# EAGLE design csa_pwr-v1.3b (EAGLE 5.11)

## Sheet 1 of 3
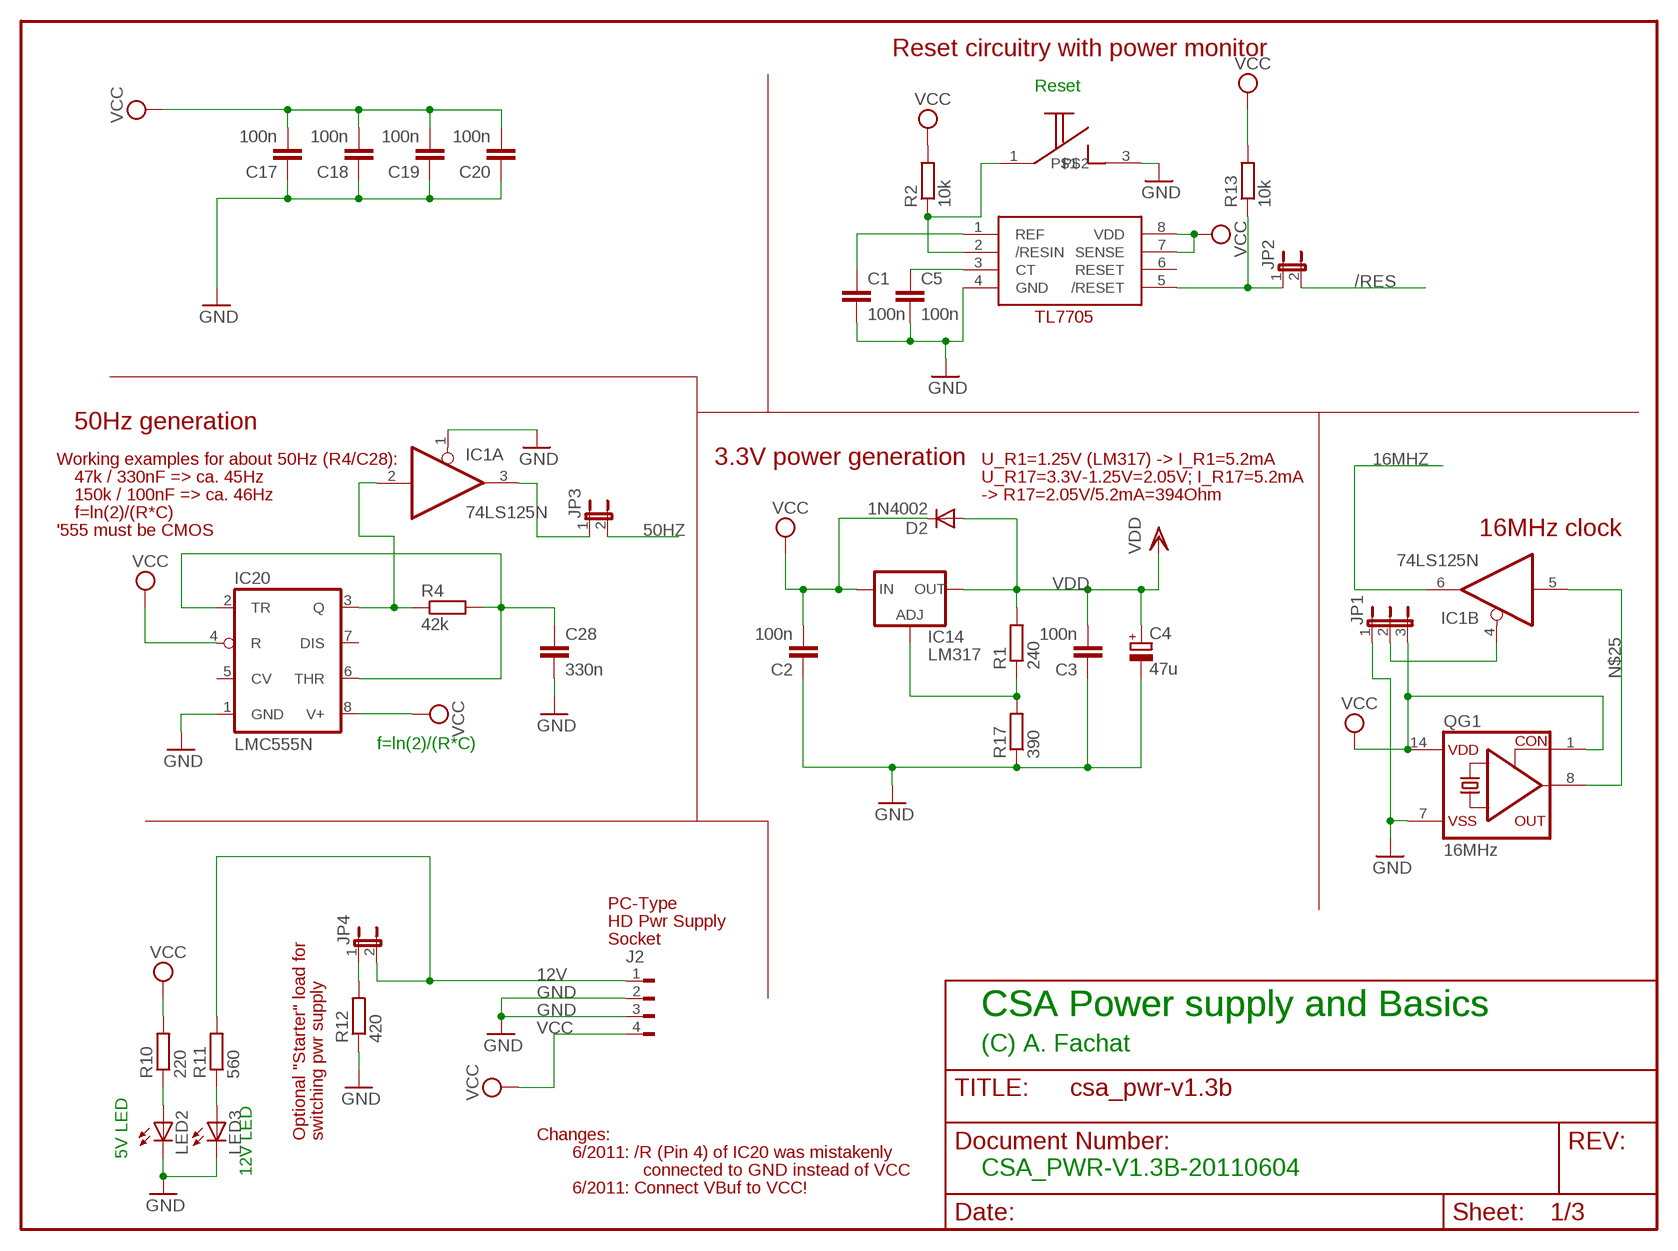
[diagram p0: schematic, sheet 1]

### Parts
C1  100n  C-EU025-025X050  [C025-025X050]
C2  100n  C5/2.5  [C5B2.5]
C3  100n  C5/2.5  [C5B2.5]
C4  47u  CPOL-EUE2.5-7  [E2,5-7]
C5  100n  C-EU025-025X050  [C025-025X050]
C17  100n  C5/2.5  [C5B2.5]
C18  100n  C5/2.5  [C5B2.5]
C19  100n  C5/2.5  [C5B2.5]
C20  100n  C5/2.5  [C5B2.5]
C28  330n  C-EU050-025X075  [C050-025X075]
D2  1N4002  DIODE-C1702-15  [C1702-15]
IC1  74LS125N  [DIL14]
IC14  LM317  LM317TL  [317TL]
IC20  LMC555N  LM555N  [DIL08]
J2  FLOP-4W827001  [827001]
JP1  JP2E  [JP2]
JP2  JP1E  [JP1]
JP3  JP1E  [JP1]
JP4  JP1E  [JP1]
LED2  LED3MM  [LED3MM]
LED3  LED3MM  [LED3MM]
QG1  16MHz  CRYSTAL_RES-SG51  [SG51]
R1  240  R-EU_0204/5  [0204/5]
R2  10k  R-EU_0207/10  [0207/10]
R4  42k  R-EU_0204/7  [0204/7]
R10  220  R-EU_0204/5  [0204/5]
R11  560  R-EU_0204/5  [0204/5]
R12  420  R-EU_RDH/15  [RDH/15]
R13  10k  R-EU_0207/10  [0207/10]
R17  390  R-EU_0204/5  [0204/5]
U$1  TL7705  [DIL08]
U$2  TASTER  [TASTER]

### Nets
12V: J2.1 JP4.2 R11.2
16MHZ: IC1.6(B:O) ; also sheet 2
50HZ: JP3.2 ; also sheet 2
/RES: JP2.2 ; also sheet 2
GND: C1.2 C2.1 C3.1 C4.- C5.2 C17.1 C18.1 C19.1 C20.1 C28.2 IC1.1(A:OE) IC20.1(GND) J2.2 J2.3 JP1.1 LED2.K(C) LED3.K(C) QG1.7(VSS) R12.1 R17.1 U$1.4(GND) U$2.3 ; also sheet 2
N$1: C5.1 U$1.3(CT)
N$2: IC14.1(ADJ) R1.1 R17.2
N$3: C1.1 U$1.1(REF)
N$4: JP2.1 R13.1 U$1.5(/RESET)
N$6: IC1.2(A:I) IC20.3(Q) R4.1
N$7: R2.1 U$1.2(/RESIN) U$2.1
N$9: IC1.4(B:OE) JP1.2
N$18: LED2.A R10.1
N$19: LED3.A R11.1
N$21: JP4.1 R12.2
N$25: IC1.5(B:I) QG1.8(OUT)
N$55: IC1.3(A:O) JP3.1
N$56: C28.1 IC20.2(TR) IC20.6(THR) R4.2
VCC: C2.2 C17.2 C18.2 C19.2 C20.2 D2.C IC14.3(IN) IC20.4(R) IC20.8(V+) J2.4 JP1.3 QG1.1(CON) QG1.14(VDD) R2.2 R10.2 R13.2 U$1.7(SENSE) U$1.8(VDD) ; also sheet 2
VDD: C3.2 C4.+ D2.A IC14.2(OUT) R1.2 ; also sheet 2
Unconnected: IC1.8(C:O) IC1.9(C:I) IC1.10(C:OE) IC1.11(D:O) IC1.12(D:I) IC1.13(D:OE) IC20.5(CV) IC20.7(DIS) U$1.6(RESET)

### Notes on the sheet
- Reset circuitry with power monitor
- Reset
- 50Hz generation
- Working examples for about 50Hz (R4/C28): | 3.3V power generation | U_R1=1.25V (LM317) -> I_R1=5.2mA
- 47k / 330nF => ca. 45Hz | U_R17=3.3V-1.25V=2.05V; I_R17=5.2mA
- 150k / 100nF => ca. 46Hz | -> R17=2.05V/5.2mA=394Ohm
- f=ln(2)/(R*C)
- '555 must be CMOS | 16MHz clock
- f=ln(2)/(R*C)
- PC-Type
- HD Pwr Supply
- Socket
- CSA Power supply and Basics | CSA Power supply and Basics
- (C) A. Fachat
- Optional "Starter" load for | switching pwr supply | Changes:
- 5V LED | 6/2011: /R (Pin 4) of IC20 was mistakenly
- 12V LED | connected to GND instead of VCC | CSA_PWR-V1.3B-20110604
- 6/2011: Connect VBuf to VCC!

## Sheet 2 of 3
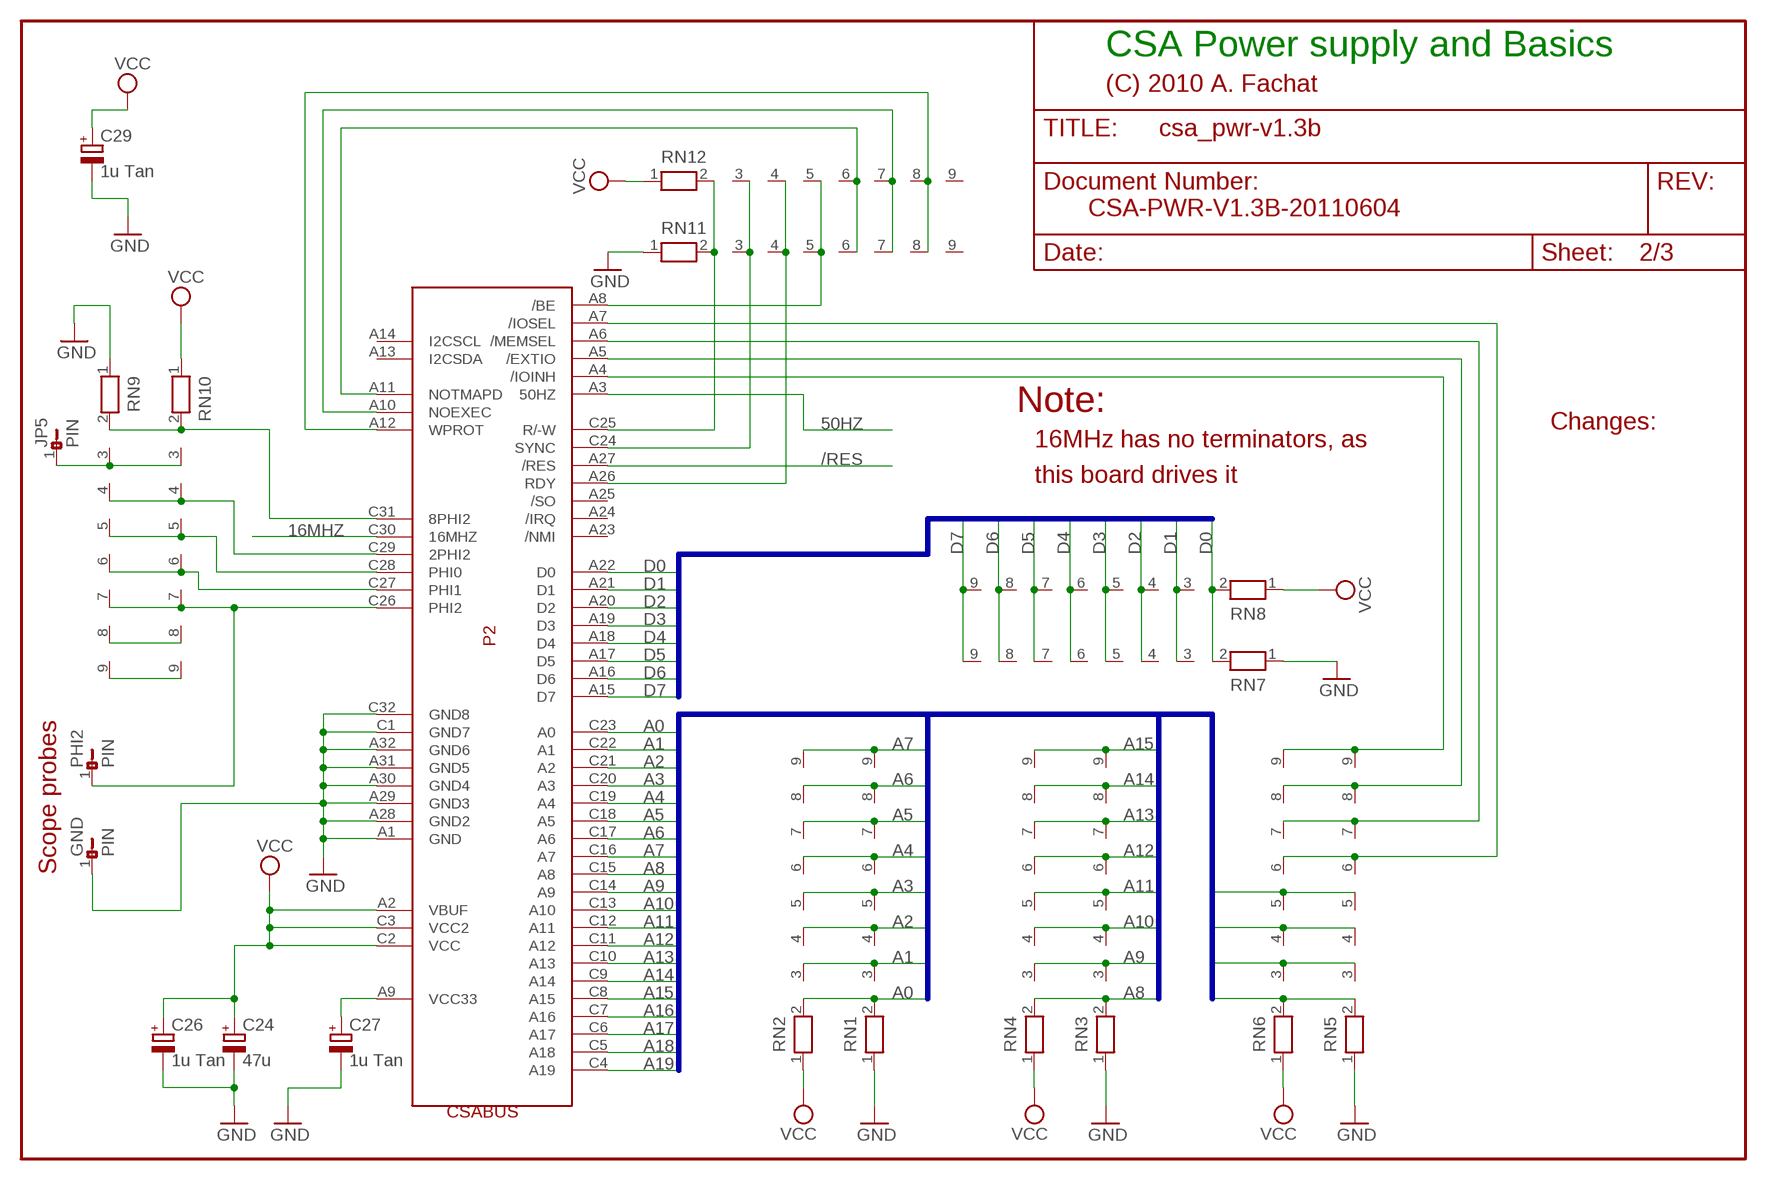
[diagram p1: schematic, sheet 2]

### Parts
C24  47u  CPOL-EUE2.5-7  [E2,5-7]
C26  1u Tan  CPOL-EUTT2D5  [TT2D5]
C27  1u Tan  CPOL-EUTT2D5  [TT2D5]
C29  1u Tan  CPOL-EUTT2D5  [TT2D5]
GND  PIN  [PIN]
JP5  PIN  [PIN]
P2  CSABUS  [CSABUS]
PHI2  PIN  [PIN]
RN1  RN08  [RN-9]
RN2  RN08  [RN-9]
RN3  RN08  [RN-9]
RN4  RN08  [RN-9]
RN5  RN08  [RN-9]
RN6  RN08  [RN-9]
RN7  RN08  [RN-9]
RN8  RN08  [RN-9]
RN9  RN08  [RN-9]
RN10  RN08  [RN-9]
RN11  RN08  [RN-9]
RN12  RN08  [RN-9]

### Nets
16MHZ: P2.C30(16MHZ) ; also sheet 1
50HZ: P2.A3(50HZ) ; also sheet 1
/RES: P2.A27(/RES) ; also sheet 1
A0: P2.C23(A0) RN1.2 RN2.2
A1: P2.C22(A1) RN1.3 RN2.3
A2: P2.C21(A2) RN1.4 RN2.4
A3: P2.C20(A3) RN1.5 RN2.5
A4: P2.C19(A4) RN1.6 RN2.6
A5: P2.C18(A5) RN1.7 RN2.7
A6: P2.C17(A6) RN1.8 RN2.8
A7: P2.C16(A7) RN1.9 RN2.9
A8: P2.C15(A8) RN3.2 RN4.2
A9: P2.C14(A9) RN3.3 RN4.3
A10: P2.C13(A10) RN3.4 RN4.4
A11: P2.C12(A11) RN3.5 RN4.5
A12: P2.C11(A12) RN3.6 RN4.6
A13: P2.C10(A13) RN3.7 RN4.7
A14: P2.C9(A14) RN3.8 RN4.8
A15: P2.C8(A15) RN3.9 RN4.9
A16: P2.C7(A16) RN5.2 RN6.2
A17: P2.C6(A17) RN5.3 RN6.3
A18: P2.C5(A18) RN5.4 RN6.4
A19: P2.C4(A19) RN5.5 RN6.5
D0: P2.A22(D0) RN7.2 RN8.2
D1: P2.A21(D1) RN7.3 RN8.3
D2: P2.A20(D2) RN7.4 RN8.4
D3: P2.A19(D3) RN7.5 RN8.5
D4: P2.A18(D4) RN7.6 RN8.6
D5: P2.A17(D5) RN7.7 RN8.7
D6: P2.A16(D6) RN7.8 RN8.8
D7: P2.A15(D7) RN7.9 RN8.9
GND: C24.- C26.- C27.- C29.- GND.1 P2.A1(GND) P2.A28(GND2) P2.A29(GND3) P2.A30(GND4) P2.A31(GND5) P2.A32(GND6) P2.C1(GND7) P2.C32(GND8) RN1.1 RN3.1 RN5.1 RN7.1 RN9.1 RN11.1 ; also sheet 1
N$5: JP5.1 RN9.3 RN10.3
N$26: P2.A4(/IOINH) RN5.9 RN6.9
N$31: P2.A5(/EXTIO) RN5.8 RN6.8
N$32: P2.A6(/MEMSEL) RN5.7 RN6.7
N$33: P2.A7(/IOSEL) RN5.6 RN6.6
N$34: RN9.9 RN10.9
N$35: P2.C27(PHI1) RN9.6 RN10.6
N$36: P2.C28(PHI0) RN9.5 RN10.5
N$37: P2.C29(2PHI2) RN9.4 RN10.4
N$39: P2.C31(8PHI2) RN9.2 RN10.2
N$40: P2.C26(PHI2) PHI2.1 RN9.7 RN10.7
N$41: RN9.8 RN10.8
N$42: P2.A8(/BE) RN11.5 RN12.5
N$43: P2.A11(NOTMAPD) RN11.6 RN12.6
N$44: P2.A10(NOEXEC) RN11.7 RN12.7
N$45: P2.A12(WPROT) RN11.8 RN12.8
N$46: P2.C24(SYNC) RN11.3 RN12.3
N$47: P2.A26(RDY) RN11.4 RN12.4
N$48: P2.C25(R/-W) RN11.2 RN12.2
VCC: C24.+ C26.+ C29.+ P2.A2(VBUF) P2.C2(VCC) P2.C3(VCC2) RN2.1 RN4.1 RN6.1 RN8.1 RN10.1 RN12.1 ; also sheet 1
VDD: C27.+ P2.A9(VCC33) ; also sheet 1
Unconnected: P2.A13(I2CSDA) P2.A14(I2CSCL) P2.A23(/NMI) P2.A24(/IRQ) P2.A25(/SO) RN11.9 RN12.9

### Buses
A[0..19]
D[0..7]

### Notes on the sheet
- CSA Power supply and Basics
- (C) 2010 A. Fachat
- CSA-PWR-V1.3B-20110604
- Note:
- Changes:
- 16MHz has no terminators, as
- this board drives it
- Scope probes

## Sheet 3 of 3
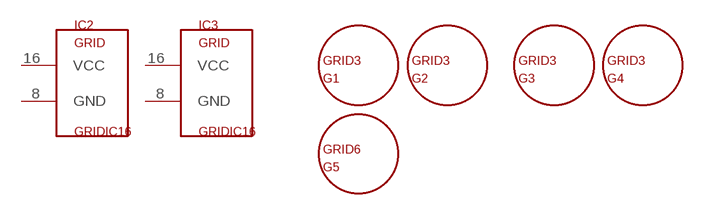
[diagram p2: schematic, sheet 3]

### Parts
G1  GRID3  [GRID3]
G2  GRID3  [GRID3]
G3  GRID3  [GRID3]
G4  GRID3  [GRID3]
G5  GRID6  [GRID6]
IC2  GRIDIC16  [GRIDIC8]
IC3  GRIDIC16  [GRIDIC8]

## Power pins joined to a net without a drawn wire
GND: IC1.7(P:GND) IC2.8(GND) IC3.8(GND)
VCC: IC1.14(P:VCC) IC2.16(VCC) IC3.16(VCC)

## Library data of the parts
C1 C5 C28 = rcl:C-EU: CAPACITOR, European symbol
C2 C3 C17-C20 = capacitor-wima:C: CAPACITOR naming: grid - package width
C4 C24 C26 C27 C29 = rcl:CPOL-EU: POLARIZED CAPACITOR, European symbol
D2 = diode:DIODE-: DIODE
G1-G5 = csa:GRID
GND JP5 PHI2 = csa:PIN
IC1 = 74xx-eu:74*125: Quad bus BUFFER, 3-state
IC2 IC3 = csa:GRIDIC
IC14 = v-reg:LM317TL: VOLTAGE REGULATOR
IC20 = linear:*555: TIMER
J2 = con-amp:FLOP-4W: MATE N-LOCK Floppy / HDD conector Distributor: Bürklin 71F972
JP1 = jumper:JP2E: JUMPER
JP2-JP4 = jumper:JP1E: JUMPER
LED2 LED3 = led:LED: LED OSRAM: - CHIPLED LG R971, LG N971, LY N971, LG Q971, LY Q971, LO R971, LY R971 LH N974, LH R974 LS Q976, LO Q976, LY Q976 LO Q996 - Hyper CHIPLED LW Q18S LB Q993, LB Q99A, LB R99A - SideLED LS A670, LO A670, LY A670, LG A670, LP A670 LB A673, LV A673, LT A673, LW A673 LH A674 LY A675 LS A676, LA A676, LO A676, LY A676, LW A676 LS A679, LY A679, LG A679 - Hyper Micro SIDELED® LS Y876, LA Y876, LO Y876, LY Y876 LT Y87S - SmartLED LW L88C, LW L88S LB L89C, LB L89S, LG L890 LS L89K, LO L89K, LY L89K LS L896, LA L896, LO L896, LY L896 - TOPLED LS T670, LO T670, LY T670, LG T670, LP T670 LSG T670, LSP T670, LSY T670, LOP T670, LYG T670 LG T671, LOG T671, LSG T671 LB T673, LV T673, LT T673, LW T673 LH T674 LS T676, LA T676, LO T676, LY T676, LB T676, LH T676, LSB T676, LW T676 LB T67C, LV T67C, LT T67C, LS T67K, LO T67K, LY T67K, LW E67C LS E67B, LA E67B, LO E67B, LY E67B, LB E67C, LV E67C, LT E67C LW T67C LS T679, LY T679, LG T679 LS T770, LO T770, LY T770, LG T770, LP T770 LB T773, LV T773, LT T773, LW T773 LH T774 LS E675, LA E675, LY E675, LS T675 LS T776, LA T776, LO T776, LY T776, LB T776 LHGB T686 LT T68C, LB T68C - Hyper Mini TOPLED® LB M676 - Mini TOPLED Santana® LG M470 LS M47K, LO M47K, LY M47K Source: http://www.osram.convergy.de/
P2 = csa:CSABUS
QG1 = crystal:CRYSTAL_RES-: CRYSTAL RESONATOR
R1 R2 R4 R10-R13 R17 = rcl:R-EU_: RESISTOR, European symbol
RN1-RN12 = resistor-net:RN08: RESISTOR NETWORK
U$1 = csa:TL7705
U$2 = csa:TASTER

## Board
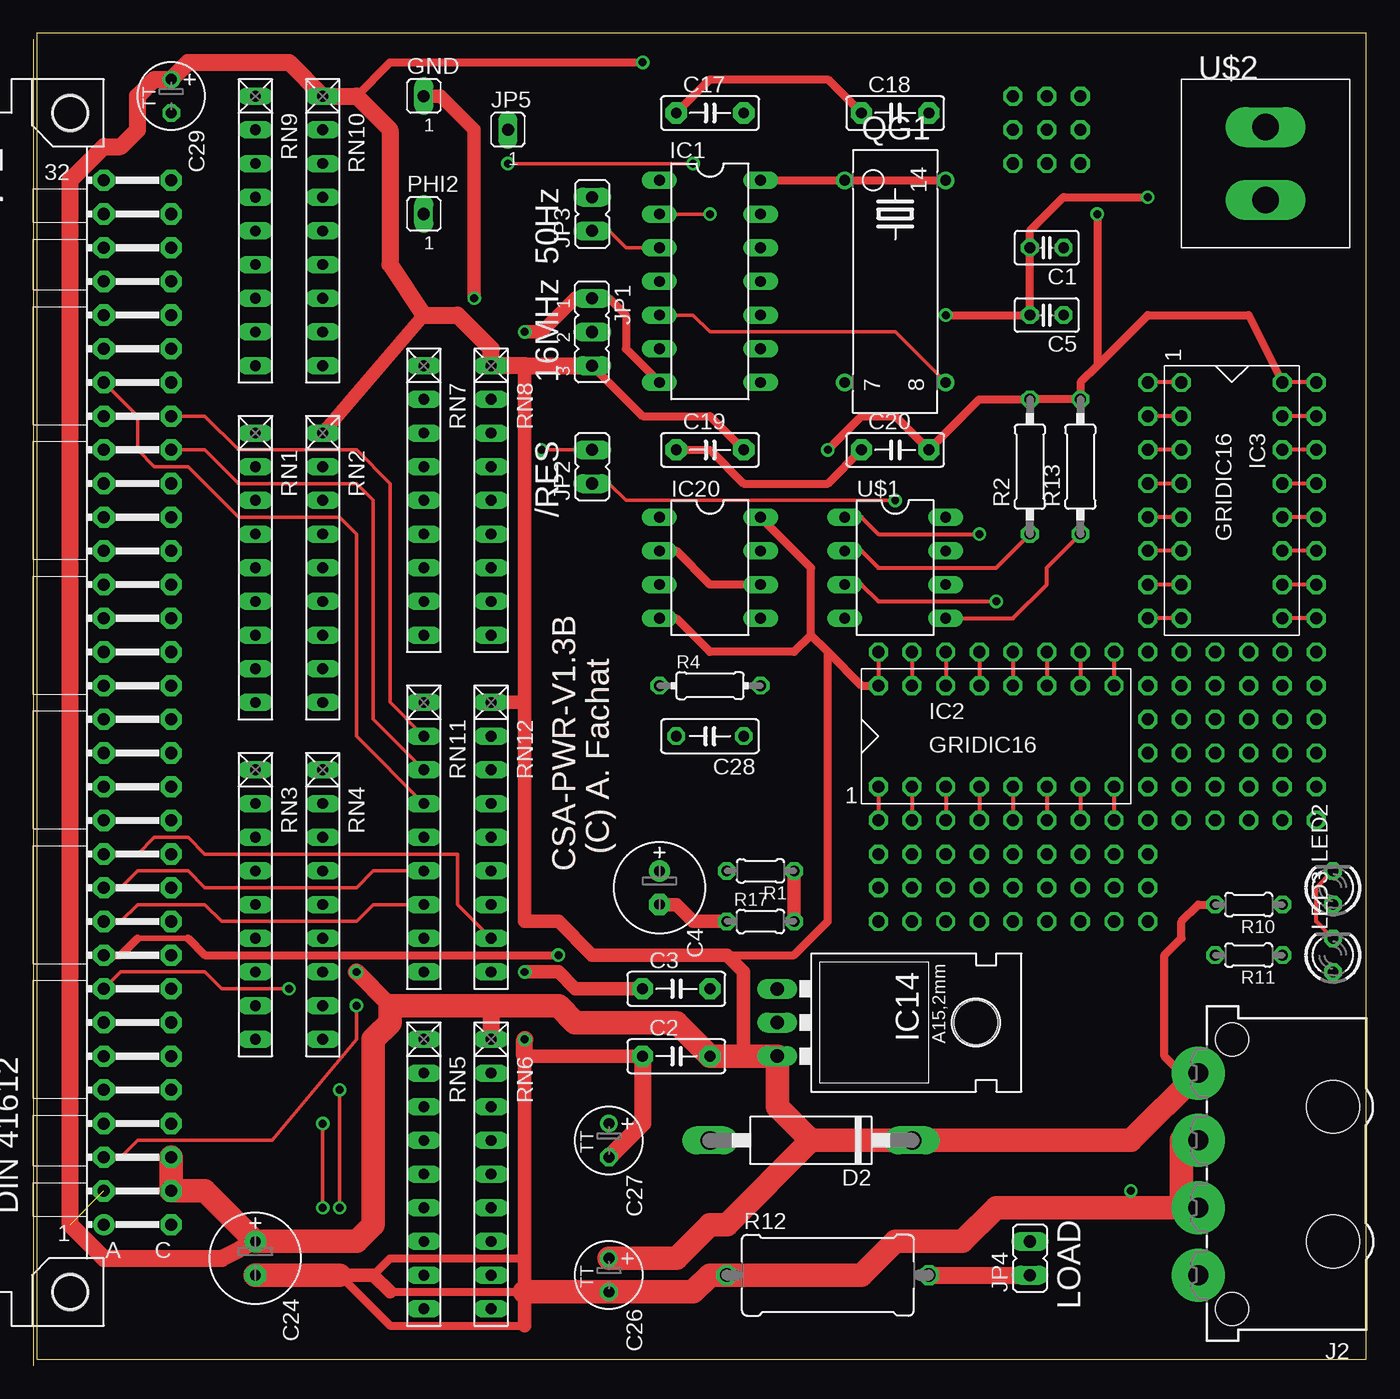
[diagram p3: board, top side]
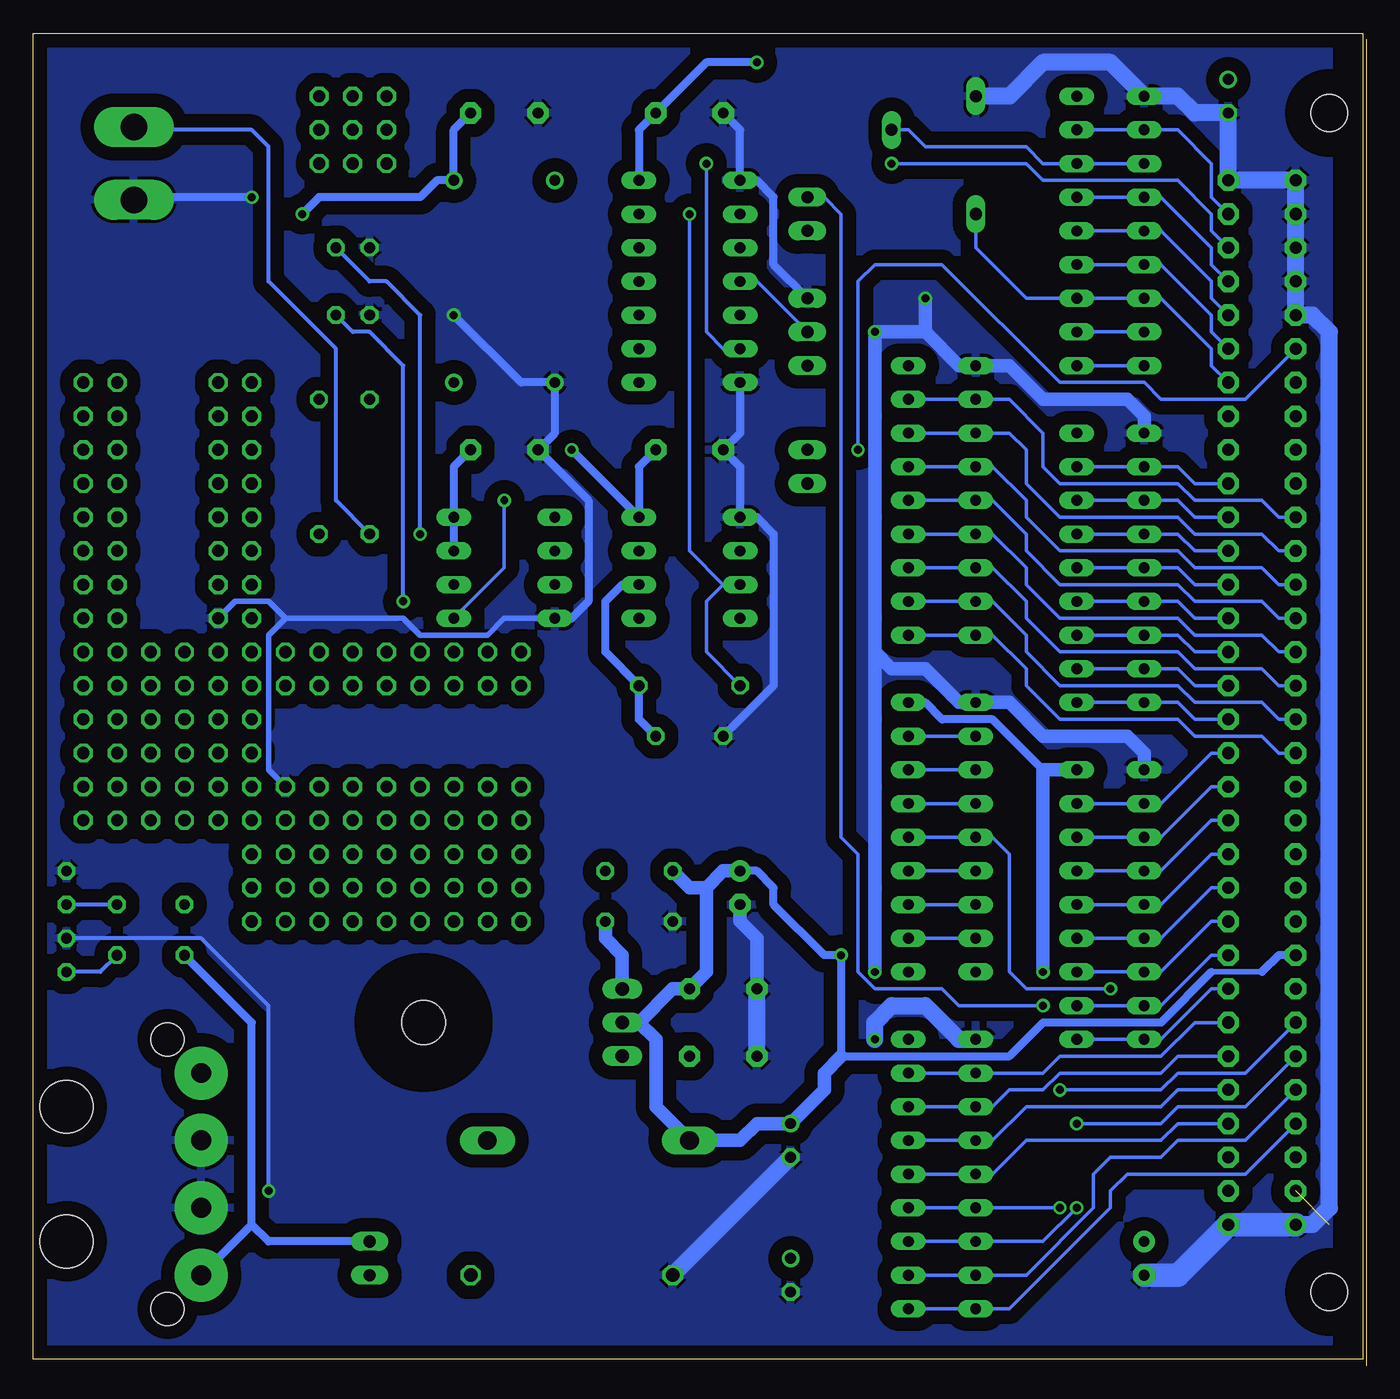
[diagram p4: board, bottom side, seen from below]

Size 100.31 x 100 mm. Coordinates in mm from the lower left corner, seen from the top.
Outline: 0,0 100.31,0 100.31,100 0,100 0,0
Copper layers (1*16): Top 0.035mm / dielectric 1.5mm / Bottom 0.035mm
Design rules "default *": minimum track width 10mil, minimum drill 12mil, track to track 8mil, track to pad 8mil, pad to pad 8mil, via to via 8mil, smd to smd 8mil, copper to edge 40mil, drill to drill 8mil, minimum pad ring 10mil, minimum via ring 8mil, stop-mask expansion 4mil, vias tented up to drill 0mil, thermal gap 10mil

### Footprints (pad centres in the part's own frame; a part is rotated, then mirrored left to right if it is on the bottom)
C025-025X050 = drill 0.813 octagon: 1 -1.27,0; 2 1.27,0
C5B2.5 = drill 0.813 pad 1.6 octagon: 1 -2.54,0; 2 2.54,0
E2,5-7 = drill 0.813 pad 1.6 round: + -1.27,0 | drill 0.813 pad 1.6 octagon: - 1.27,0
TT2D5 = drill 0.813 round: + -1.27,0 | drill 0.813 octagon: - 1.27,0
C050-025X075 = drill 0.813 octagon: 1 -2.54,0; 2 2.54,0
C1702-15 = drill 1.397 long: A 7.62,0; C -7.62,0
GRID3 = drill 0.914 octagon: 1 -2.54,2.54; 2 0,2.54; 3 2.54,2.54; 13 -2.54,-2.54; 14 0,-2.54; 15 2.54,-2.54; A2 -2.54,0; B2 0,0; C2 2.54,0
GRID6 = drill 0.914 octagon: 1 -6.35,-1.27; 2 -3.81,-1.27; 3 -1.27,-1.27; 4 1.27,-1.27; 5 3.81,-1.27; 6 6.35,-1.27; 7 -6.35,3.81; 8 -3.81,3.81; 9 -1.27,3.81; 10 1.27,3.81; 11 3.81,3.81; 12 6.35,3.81; 13 -6.35,-6.35; 14 -3.81,-6.35; 15 -1.27,-6.35; 16 1.27,-6.35; 17 3.81,-6.35; 18 6.35,-6.35; A -6.35,1.27; A1 -6.35,6.35; A2 -6.35,-3.81; B -3.81,1.27; B1 -3.81,6.35; B2 -3.81,-3.81; C -1.27,1.27; C1 -1.27,6.35; C2 -1.27,-3.81; D 1.27,1.27; D1 1.27,6.35; D2 1.27,-3.81; E 3.81,1.27; E1 3.81,6.35; E2 3.81,-3.81; F 6.35,1.27; F1 6.35,6.35; F2 6.35,-3.81
PIN = drill 0.914 long: 1 0,0
DIL14 = drill 0.813 long: 1 -7.62,-3.81; 2 -5.08,-3.81; 3 -2.54,-3.81; 4 0,-3.81; 5 2.54,-3.81; 6 5.08,-3.81; 7 7.62,-3.81; 8 7.62,3.81; 9 5.08,3.81; 10 2.54,3.81; 11 0,3.81; 12 -2.54,3.81; 13 -5.08,3.81; 14 -7.62,3.81
GRIDIC8 = drill 0.914 octagon: 1 -8.89,-3.81; 1@1 -8.89,-6.35; 2 -6.35,-3.81; 2@1 -6.35,-6.35; 3 -3.81,-3.81; 3@1 -3.81,-6.35; 4 -1.27,-3.81; 4@1 -1.27,-6.35; 5 1.27,-3.81; 5@1 1.27,-6.35; 6 3.81,-3.81; 6@1 3.81,-6.35; 7 6.35,-3.81; 7@1 6.35,-6.35; 8 8.89,-3.81; 8@1 8.89,-6.35; 9 8.89,3.81; 9@1 8.89,6.35; 10 6.35,3.81; 10@1 6.35,6.35; 11 3.81,3.81; 11@1 3.81,6.35; 12 1.27,3.81; 12@1 1.27,6.35; 13 -1.27,3.81; 13@1 -1.27,6.35; 14 -3.81,3.81; 14@1 -3.81,6.35; 15 -6.35,3.81; 15@1 -6.35,6.35; 16 -8.89,3.81; 16@1 -8.89,6.35
317TL = drill 1.016 long: 1 -2.54,-3.81; 2 0,-3.81; 3 2.54,-3.81 | hole 3.302: 0,11.176
DIL08 = drill 0.813 long: 1 -3.81,-3.81; 2 -1.27,-3.81; 3 1.27,-3.81; 4 3.81,-3.81; 5 3.81,3.81; 6 1.27,3.81; 7 -1.27,3.81; 8 -3.81,3.81
827001 = drill 1.5 pad 4 round: 1 -7.62,0; 2 -2.54,0; 3 2.54,0; 4 7.62,0 | hole 4: 5.08,-10.16; -5.08,-10.16 | hole 2.5: 10.16,-2.54; -10.16,-2.54
JP2 = drill 0.914 long: 1 -2.54,0; 2 0,0; 3 2.54,0
JP1 = drill 0.914 long: 1 0,-1.27; 2 0,1.27
LED3MM = drill 0.813 octagon: A -1.27,0; K 1.27,0
CSABUS = drill 0.914 pad 1.6 round: A1 7.62,36.83 | drill 0.914 pad 1.6 octagon: A2 7.62,34.29; A3 7.62,31.75; A4 7.62,29.21; A5 7.62,26.67; A6 7.62,24.13; A7 7.62,21.59; A8 7.62,19.05; A9 7.62,16.51; A10 7.62,13.97; A11 7.62,11.43; A12 7.62,8.89; A13 7.62,6.35; A14 7.62,3.81; A15 7.62,1.27; A16 7.62,-1.27; A17 7.62,-3.81; A18 7.62,-6.35; A19 7.62,-8.89; A20 7.62,-11.43; A21 7.62,-13.97; A22 7.62,-16.51; A23 7.62,-19.05; A24 7.62,-21.59; A25 7.62,-24.13; A26 7.62,-26.67; A27 7.62,-29.21; A28 7.62,-31.75; A29 7.62,-34.29; A30 7.62,-36.83; A31 7.62,-39.37; A32 7.62,-41.91; C1 2.54,36.83; C2 2.54,34.29; C3 2.54,31.75; C4 2.54,29.21; C5 2.54,26.67; C6 2.54,24.13; C7 2.54,21.59; C8 2.54,19.05; C9 2.54,16.51; C10 2.54,13.97; C11 2.54,11.43; C12 2.54,8.89; C13 2.54,6.35; C14 2.54,3.81; C15 2.54,1.27; C16 2.54,-1.27; C17 2.54,-3.81; C18 2.54,-6.35; C19 2.54,-8.89; C20 2.54,-11.43; C21 2.54,-13.97; C22 2.54,-16.51; C23 2.54,-19.05; C24 2.54,-21.59; C25 2.54,-24.13; C26 2.54,-26.67; C27 2.54,-29.21; C28 2.54,-31.75; C29 2.54,-34.29; C30 2.54,-36.83; C31 2.54,-39.37; C32 2.54,-41.91 | hole 2.794: 10.16,41.91; 10.16,-46.99
SG51 = drill 0.813 round: 1 -7.62,-3.81; 7 7.62,-3.81; 8 7.62,3.81; 14 -7.62,3.81
0204/5 = drill 0.813 octagon: 1 -2.54,0; 2 2.54,0
0207/10 = drill 0.813 octagon: 1 -5.08,0; 2 5.08,0
0204/7 = drill 0.813 octagon: 1 -3.81,0; 2 3.81,0
RDH/15 = drill 1.016 octagon: 1 -7.62,0; 2 7.62,0
RN-9 = drill 0.813 long: 1 -10.16,0; 2 -7.62,0; 3 -5.08,0; 4 -2.54,0; 5 0,0; 6 2.54,0; 7 5.08,0; 8 7.62,0; 9 10.16,0
DIL08' = drill 0.813 long: 1 -11.43,-2.54; 2 -8.89,-2.54; 3 -6.35,-2.54; 4 -3.81,-2.54; 5 -3.81,5.08; 6 -6.35,5.08; 7 -8.89,5.08; 8 -11.43,5.08
TASTER = drill 2.007 long: 1 0,4.013; 3 0,-1.473

### Placement (x,y rotation side)
C1  76.2,83.82 180 top
C2  48.26,22.86 0 top
C3  48.26,27.94 0 top
C4  46.99,35.56 270 top
C5  76.2,78.74 180 top
C17  50.8,93.98 0 top
C18  64.77,93.98 0 top
C19  50.8,68.58 0 top
C20  64.77,68.58 0 top
C24  16.51,7.62 270 top
C26  43.18,6.35 270 top
C27  43.18,16.51 270 top
C28  50.8,46.99 180 top
C29  10.16,95.25 270 top
D2  58.42,16.51 180 top
G1  66.04,35.56 0 top
G2  81.28,35.56 0 top
G3  73.66,35.56 0 top
G4  76.2,92.71 0 top
G5  90.17,46.99 0 top
GND  29.21,95.25 0 top
IC1  50.8,81.28 270 top
IC2  72.39,46.99 0 top
IC3  90.17,64.77 270 top
IC14  59.69,25.4 270 top
IC20  50.8,59.69 270 top
J2  87.63,13.97 90 top
JP1  41.91,77.47 270 top
JP2  41.91,67.31 0 top
JP3  41.91,86.36 0 top
JP4  74.93,7.62 0 top
JP5  35.56,92.71 0 top
LED2  97.79,35.56 90 top
LED3  97.79,30.48 90 top
P2  12.7,46.99 180 top
PHI2  29.21,86.36 0 top
QG1  64.77,81.28 270 top
R1  54.61,36.83 180 top
R2  74.93,67.31 90 top
R4  50.8,50.8 0 top
R10  91.44,34.29 180 top
R11  91.44,30.48 180 top
R12  59.69,6.35 0 top
R13  78.74,67.31 90 top
R17  54.61,33.02 0 top
RN1  16.51,59.69 270 top
RN2  21.59,59.69 270 top
RN3  16.51,34.29 270 top
RN4  21.59,34.29 270 top
RN5  29.21,13.97 270 top
RN6  34.29,13.97 270 top
RN7  29.21,64.77 270 top
RN8  34.29,64.77 270 top
RN9  16.51,85.09 270 top
RN10  21.59,85.09 270 top
RN11  29.21,39.37 270 top
RN12  34.29,39.37 270 top
U$1  TL7705  [DIL08']  63.5,52.07 270 top
U$2  92.71,88.9 0 top

### Tracks (layer width: path | path; a pad name or v marks a point on that pad's centre or on a via)
12V
  Bottom 0.61: R11.2 83.82,25.4 83.82,10.16 | 83.82,10.16 J2.1 | JP4.2 82.55,8.89 83.82,10.16
16MHZ  (via drill 0.6)
  Top 0.254: v35.56,90.17 v49.53,90.17
  Bottom 0.254: P2.C30 11.43,85.09 11.43,86.36 13.97,88.9 24.13,88.9 25.4,90.17 v35.56,90.17 | v49.53,90.17 49.53,77.47 48.26,76.2 IC1.6
50HZ  (via drill 0.6)
  Top 0.254: P2.A3 6.35,15.24 7.62,16.51 17.78,16.51 24.13,24.13 v24.13,26.67
  Bottom 0.254: v24.13,26.67 30.48,26.67 31.75,27.94 36.83,27.94 38.1,29.21 38.1,38.1 39.37,39.37 39.37,86.36 40.64,87.63 JP3.2
/RES  (via drill 0.6)
  Top 0.254: v38.1,68.58 JP2.2
  Bottom 0.254: P2.A27 8.89,72.39 15.24,72.39 16.51,73.66 22.86,73.66 31.75,82.55 36.83,82.55 38.1,81.28 v38.1,68.58
A0
  Bottom 0.254: P2.C23 12.7,66.04 13.97,67.31 RN1.2 RN2.2
A1
  Bottom 0.254: P2.C22 12.7,63.5 13.97,64.77 RN1.3 RN2.3
A2
  Bottom 0.254: P2.C21 12.7,60.96 13.97,62.23 RN1.4 RN2.4
A3
  Bottom 0.254: P2.C20 12.7,58.42 13.97,59.69 RN1.5 RN2.5
A4
  Bottom 0.254: P2.C19 12.7,55.88 13.97,57.15 RN1.6 RN2.6
A5
  Bottom 0.254: P2.C18 12.7,53.34 13.97,54.61 RN1.7 RN2.7
A6
  Bottom 0.254: P2.C17 12.7,50.8 13.97,52.07 RN1.8 RN2.8
A7
  Bottom 0.254: P2.C16 12.7,48.26 13.97,49.53 RN1.9 RN2.9
A8
  Bottom 0.254: P2.C15 11.43,45.72 15.24,41.91 RN3.2 RN4.2
A9
  Bottom 0.254: P2.C14 11.43,43.18 15.24,39.37 RN3.3 RN4.3
A10
  Bottom 0.254: P2.C13 11.43,40.64 15.24,36.83 RN3.4 RN4.4
A11
  Bottom 0.254: P2.C12 11.43,38.1 15.24,34.29 RN3.5 RN4.5
A12
  Bottom 0.254: P2.C11 11.43,35.56 15.24,31.75 RN3.6 RN4.6
A13
  Bottom 0.254: P2.C10 11.43,33.02 15.24,29.21 RN3.7 RN4.7
A14
  Bottom 0.254: P2.C9 11.43,30.48 15.24,26.67 RN3.8 RN4.8
A15
  Bottom 0.254: P2.C8 11.43,27.94 15.24,24.13 RN3.9 RN4.9
A16
  Bottom 0.254: P2.C7 12.7,25.4 15.24,22.86 22.86,22.86 24.13,21.59 RN5.2 RN6.2
A17
  Bottom 0.254: P2.C6 13.97,22.86 15.24,21.59 22.86,21.59 24.13,20.32 26.67,20.32 27.94,19.05 RN6.3 RN5.3
A18
  Bottom 0.254: P2.C5 13.97,20.32 15.24,19.05 25.4,19.05 27.94,16.51 RN6.4 RN5.4
A19
  Bottom 0.254: P2.C4 13.97,17.78 15.24,16.51 25.4,16.51 27.94,13.97 RN6.5 RN5.5
D0
  Bottom 0.254: P2.A22 6.35,63.5 7.62,64.77 12.7,64.77 13.97,66.04 22.86,66.04 24.13,67.31 24.13,69.85 26.67,72.39 RN7.2 RN8.2
D1
  Bottom 0.254: P2.A21 6.35,60.96 7.62,62.23 12.7,62.23 13.97,63.5 22.86,63.5 25.4,66.04 25.4,68.58 26.67,69.85 RN7.3 RN8.3
D2
  Bottom 0.254: P2.A20 6.35,58.42 7.62,59.69 12.7,59.69 13.97,60.96 22.86,60.96 25.4,63.5 25.4,64.77 27.94,67.31 RN7.4 RN8.4
D3
  Bottom 0.254: P2.A19 6.35,55.88 7.62,57.15 12.7,57.15 13.97,58.42 22.86,58.42 25.4,60.96 25.4,62.23 27.94,64.77 RN7.5 RN8.5
D4
  Bottom 0.254: P2.A18 6.35,53.34 7.62,54.61 12.7,54.61 13.97,55.88 22.86,55.88 25.4,58.42 25.4,59.69 27.94,62.23 RN7.6 RN8.6
D5
  Bottom 0.254: P2.A17 6.35,50.8 7.62,52.07 12.7,52.07 13.97,53.34 22.86,53.34 25.4,55.88 25.4,57.15 27.94,59.69 RN7.7 RN8.7
D6
  Bottom 0.254: P2.A16 6.35,48.26 7.62,49.53 12.7,49.53 13.97,50.8 22.86,50.8 25.4,53.34 25.4,54.61 27.94,57.15 RN7.8 RN8.8
D7
  Bottom 0.254: P2.A15 6.35,45.72 7.62,46.99 12.7,46.99 13.97,48.26 22.86,48.26 25.4,50.8 25.4,52.07 27.94,54.61 RN7.9 RN8.9
GND  (via drill 0.6)
  Top 0.305: LED2.K 96.52,35.56 96.52,33.02 LED3.K | 82.55,11.43 v82.55,12.7
  Top 0.61: 22.86,6.35 26.67,2.54 36.83,2.54 | C17.1 50.8,96.52 59.69,96.52 C18.1 | JP1.1 43.18,80.01 44.45,78.74 44.45,76.2 IC1.7 | C19.1 50.8,68.58 53.34,66.04 59.69,66.04 C20.1 | v68.58,78.74 C5.2 C1.2 74.93,85.09 77.47,87.63 v83.82,87.63 | 26.67,5.08 36.83,5.08 | 25.4,6.35 26.67,7.62 36.83,7.62
  Top 1.016: v36.83,77.47 38.1,77.47 40.64,80.01 JP1.1 | GND.1 30.48,95.25 33.02,92.71 v33.02,80.01 | 36.83,2.54 36.83,5.08 36.83,7.62 36.83,22.86 C2.1 | C4.- 48.26,34.29 49.53,33.02 R17.1 | v36.83,29.21 39.37,29.21 40.64,27.94 C3.1 | 22.86,6.35 25.4,6.35 26.67,5.08
  Top 1.27: C2.1 45.72,17.78 C27.- | 36.83,22.86 v36.83,24.13
  Top 1.778: J2.3 86.36,16.51 86.36,11.43 | 86.36,11.43 J2.2 | 86.36,11.43 82.55,11.43 72.39,11.43 69.85,8.89 64.77,8.89 62.23,6.35 R12.1 50.8,6.35 49.53,5.08 C26.- 36.83,5.08 | C24.- 22.86,6.35
  Bottom 0.305: LED3.K 87.63,31.75 82.55,26.67 v82.55,12.7 | 91.64,87.63 U$2.3
  Bottom 0.406: IC3.8 85.09,57.15 82.55,57.15 81.28,55.88 | 81.28,55.88 72.39,55.88 71.12,54.61 66.04,54.61 64.77,55.88 U$1.4 | 81.28,55.88 82.55,54.61 82.55,44.45 IC2.8
  Bottom 0.61: JP1.1 44.45,82.55 44.45,87.63 45.72,88.9 IC1.1 46.99,92.71 C17.1 | IC1.7 46.99,69.85 C19.1 46.99,67.31 IC20.1 45.72,63.5 44.45,62.23 44.45,50.8 C28.2 | U$1.4 59.69,55.88 58.42,57.15 58.42,64.77 C20.1 60.96,69.85 QG1.7 63.5,73.66 v68.58,78.74 | v83.82,87.63 91.64,87.63
  Bottom 1.016: RN3.1 16.51,45.72 17.78,46.99 24.13,46.99 26.67,49.53 RN11.1 30.48,49.53 33.02,52.07 35.56,52.07 36.83,53.34 | RN1.1 16.51,71.12 17.78,72.39 24.13,72.39 26.67,74.93 RN7.1 30.48,74.93 33.02,77.47 | 33.02,77.47 v36.83,77.47 36.83,53.34 | 33.02,77.47 v33.02,80.01 | C4.- 46.99,33.02 45.72,31.75 C3.1 | v36.83,29.21 36.83,53.34
  Bottom 1.27: P2.A1 3.81,10.16 2.54,11.43 2.54,77.47 3.81,78.74 P2.A28 P2.A29 P2.A30 P2.A31 P2.A32 P2.C32 C29.- 12.7,93.98 13.97,95.25 RN9.1 19.05,97.79 24.13,97.79 26.67,95.25 GND.1 | C2.1 C3.1 | R12.1 C27.- | RN5.1 30.48,24.13 33.02,26.67 35.56,26.67 36.83,25.4 v36.83,24.13
  Bottom 1.778: P2.A1 P2.C1 13.97,6.35 C24.-
  pour Bottom (isolate 1.016): 2.54,99.06 99.06,99.06 99.06,1.27 2.54,1.27
N$1  (via drill 0.6)
  Top 0.305: U$1.3 62.23,58.42 63.5,57.15 v72.39,57.15
  Bottom 0.305: v72.39,57.15 72.39,74.93 74.93,77.47 76.2,77.47 C5.1
N$2
  Top 1.016: R17.2 R1.1
  Bottom 1.016: R17.2 57.15,31.75 55.88,30.48 IC14.1
N$3  (via drill 0.6)
  Top 0.305: U$1.1 62.23,63.5 63.5,62.23 v71.12,62.23
  Bottom 0.305: v71.12,62.23 71.12,78.74 73.66,81.28 74.93,81.28 C1.1
N$4  (via drill 0.6)
  Top 0.254: JP2.1 43.18,66.04 44.45,64.77 v64.77,64.77
  Top 0.305: U$1.5 73.66,55.88 76.2,58.42 76.2,59.69 R13.1
  Bottom 0.254: v64.77,64.77 64.77,59.69 U$1.5
N$5
  Bottom 0.254: RN9.3 RN10.3 24.13,90.17 25.4,91.44 33.02,91.44 34.29,92.71 JP5.1
N$6  (via drill 0.6)
  Top 0.254: v50.8,86.36 IC1.2
  Bottom 0.254: v50.8,86.36 50.8,60.96 48.26,58.42 | 48.26,58.42 IC20.3 | 48.26,58.42 49.53,57.15 49.53,53.34 R4.1
N$7
  Top 0.305: U$1.2 62.23,60.96 63.5,59.69 72.39,59.69 R2.1
  Bottom 0.305: R2.1 77.47,64.77 77.47,76.2 82.55,81.28 82.55,91.44 83.82,92.71 92.51,92.71 U$2.1
N$9
  Bottom 0.254: JP1.2 45.72,81.28 IC1.4
N$18
  Bottom 0.305: R10.1 LED2.A
N$19
  Bottom 0.305: R11.1 95.25,29.21 LED3.A
N$21
  Top 1.27: R12.2 JP4.1
N$25
  Top 0.254: IC1.5 49.53,78.74 50.8,77.47 64.77,77.47 QG1.8
N$26
  Bottom 0.254: RN5.9 RN6.9 26.67,3.81 19.05,11.43 19.05,12.7 17.78,13.97 8.89,13.97 P2.A4
N$31
  Bottom 0.254: RN5.8 RN6.8 25.4,6.35 20.32,11.43 20.32,13.97 19.05,15.24 15.24,15.24 13.97,16.51 8.89,16.51 P2.A5
N$32  (via drill 0.6)
  Top 0.254: v21.59,17.78 v21.59,11.43
  Bottom 0.254: RN6.7 RN5.7 24.13,8.89 v21.59,11.43 | P2.A6 8.89,19.05 13.97,19.05 15.24,17.78 v21.59,17.78
N$33  (via drill 0.6)
  Top 0.254: v22.86,20.32 v22.86,11.43
  Bottom 0.254: P2.A7 8.89,21.59 13.97,21.59 15.24,20.32 v22.86,20.32 | RN5.6 RN6.6 v22.86,11.43
N$34
  Bottom 0.254: RN9.9 RN10.9
N$35
  Bottom 0.254: P2.C27 11.43,77.47 11.43,78.74 15.24,82.55 RN9.6 RN10.6
N$36
  Bottom 0.254: P2.C28 11.43,80.01 11.43,81.28 15.24,85.09 RN9.5 RN10.5
N$37
  Bottom 0.254: P2.C29 11.43,82.55 11.43,83.82 15.24,87.63 RN9.4 RN10.4
N$39
  Bottom 0.254: P2.C31 11.43,87.63 11.43,90.17 13.97,92.71 RN9.2 RN10.2
N$40
  Bottom 0.254: P2.C26 11.43,74.93 11.43,76.2 15.24,80.01 RN9.7 RN10.7 25.4,80.01 29.21,83.82 PHI2.1
N$41
  Bottom 0.254: RN9.8 RN10.8
N$42  (via drill 0.6)
  Top 0.254: v19.05,27.94 13.97,27.94 12.7,29.21 6.35,29.21 P2.A8
  Bottom 0.254: RN12.5 RN11.5 27.94,39.37 26.67,38.1 26.67,29.21 25.4,27.94 v19.05,27.94
N$43
  Top 0.254: P2.A11 6.35,35.56 7.62,36.83 11.43,36.83 12.7,35.56 24.13,35.56 25.4,36.83 RN11.6
  Bottom 0.254: RN11.6 RN12.6
N$44
  Top 0.254: P2.A10 6.35,33.02 7.62,34.29 12.7,34.29 13.97,33.02 24.13,33.02 25.4,34.29 RN11.7
  Bottom 0.254: RN11.7 RN12.7
N$45
  Top 0.254: P2.A12 7.62,38.1 8.89,39.37 11.43,39.37 12.7,38.1 31.75,38.1 31.75,34.29 RN12.8
  Bottom 0.254: RN12.8 RN11.8
N$46
  Top 0.254: RN11.3 25.4,48.26 25.4,64.77 24.13,66.04 15.24,66.04 12.7,68.58 P2.C24
  Bottom 0.254: RN11.3 RN12.3
N$47
  Top 0.254: RN11.4 24.13,46.99 24.13,62.23 22.86,63.5 15.24,63.5 11.43,67.31 8.89,67.31 7.62,68.58 7.62,71.12 P2.A26
  Bottom 0.254: RN11.4 RN12.4
N$48
  Top 0.254: RN11.2 26.67,49.53 26.67,66.04 24.13,68.58 15.24,68.58 12.7,71.12 P2.C25
  Bottom 0.254: RN11.2 RN12.2
N$55
  Top 0.254: JP3.1 43.18,85.09 44.45,83.82 IC1.3
N$56
  Top 0.61: IC20.2 48.26,60.96 50.8,58.42 IC20.6
  Bottom 0.61: IC20.6 55.88,58.42 57.15,57.15 57.15,53.34 R4.2 54.61,48.26 C28.1
VCC  (via drill 0.6)  (1 unrouted)
  Top 0.61: JP1.3 45.72,71.12 50.8,71.12 C19.2 | v59.69,68.58 62.23,71.12 64.77,71.12 C20.2 71.12,72.39 R2.2 R13.2 78.74,73.66 80.01,74.93 | IC1.14 QG1.1 QG1.14 | 24.13,95.25 26.67,97.79 v45.72,97.79 | IC2.16 62.23,50.8 59.69,53.34 | 59.69,53.34 58.42,54.61 | 58.42,54.61 58.42,59.69 IC20.8 | J2.4 86.36,21.59 85.09,22.86 85.09,30.48 86.36,31.75 86.36,33.02 87.63,34.29 R10.2 | 80.01,74.93 83.82,78.74 91.44,78.74 IC3.16 | v80.01,86.36 80.01,74.93 | 52.07,30.48 57.15,30.48 59.69,33.02 59.69,53.34 | IC20.4 48.26,55.88 50.8,53.34 57.15,53.34 58.42,54.61
  Top 1.016: 29.21,78.74 RN2.1 | 36.83,49.53 36.83,74.93 | 36.83,49.53 36.83,33.02 39.37,33.02 41.91,30.48 52.07,30.48 53.34,29.21 53.34,22.86 | RN12.1 36.83,49.53
  Top 1.27: JP1.3 36.83,74.93 RN8.1 34.29,76.2 31.75,78.74 29.21,78.74 26.67,82.55 26.67,92.71 24.13,95.25 RN10.1 19.05,97.79 11.43,97.79 C29.+ 8.89,96.52 7.62,95.25 7.62,92.71 6.35,91.44 5.08,91.44 2.54,88.9 2.54,10.16 5.08,7.62 13.97,7.62 C24.+ | 34.29,26.67 RN6.1 | 26.67,26.67 v24.13,29.21
  Top 1.778: J2.4 82.55,16.51 D2.C 58.42,16.51 | 58.42,16.51 55.88,19.05 IC14.3 53.34,22.86 C2.2 48.26,25.4 40.64,25.4 39.37,26.67 34.29,26.67 26.67,26.67 26.67,25.4 25.4,24.13 25.4,10.16 24.13,8.89 C24.+ 12.7,12.7 P2.C2 P2.C3 | C26.+ 48.26,7.62 50.8,10.16 52.07,10.16 58.42,16.51
  Bottom 0.61: 24.13,44.45 27.94,48.26 31.75,48.26 33.02,49.53 RN12.1 | IC1.14 54.61,92.71 C17.2 49.53,97.79 v45.72,97.79 | C18.2 68.58,92.71 QG1.14 69.85,88.9 71.12,87.63 78.74,87.63 v80.01,86.36 | C19.2 54.61,67.31 IC20.8 v59.69,68.58 | C20.2 68.58,67.31 U$1.8 U$1.7
  Bottom 1.016: RN4.1 24.13,44.45 v24.13,29.21
VDD  (via drill 0.6)
  Top 0.406: 7.62,31.75 11.43,31.75
  Top 0.61: P2.A9 6.35,30.48 7.62,31.75 | 11.43,31.75 12.7,30.48 v39.37,30.48
  Bottom 0.406: 7.62,29.21 11.43,29.21
  Bottom 0.61: P2.A9 6.35,30.48 7.62,29.21 | 11.43,29.21 15.24,25.4 24.13,25.4 26.67,22.86 39.37,22.86 v39.37,30.48 40.64,30.48 44.45,34.29 44.45,35.56 45.72,36.83 C4.+
  Bottom 1.016: 54.61,25.4 IC14.2 | 54.61,25.4 53.34,24.13 53.34,19.05 D2.A 46.99,16.51 45.72,17.78 C27.+ 40.64,20.32 40.64,21.59 39.37,22.86 | 54.61,25.4 52.07,27.94 C3.2 49.53,29.21 49.53,35.56 | C4.+ 48.26,36.83 49.53,35.56 | 49.53,35.56 50.8,35.56 R1.2

### Text on the board
Top: (C) A. Fachat | CSA-PWR-V1.3B
tNames: 50Hz | 16MHz | /RES | (C) A. Fachat | CSA-PWR-V1.3B | LOAD